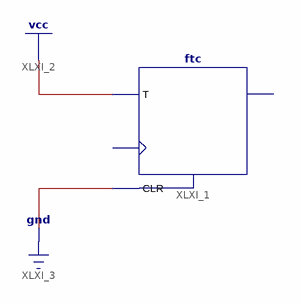
[diagram p0: schematic sheet 1]
// Xilinx ISE schematic LAB07_01.sch (spartan6) as structural Verilog: 1 symbols, 0 ports
module LAB07_01 (
);

  ftc XLXI_1 (.CLR(1'b0), .T(1'b1));  // open: C, Q
endmodule
